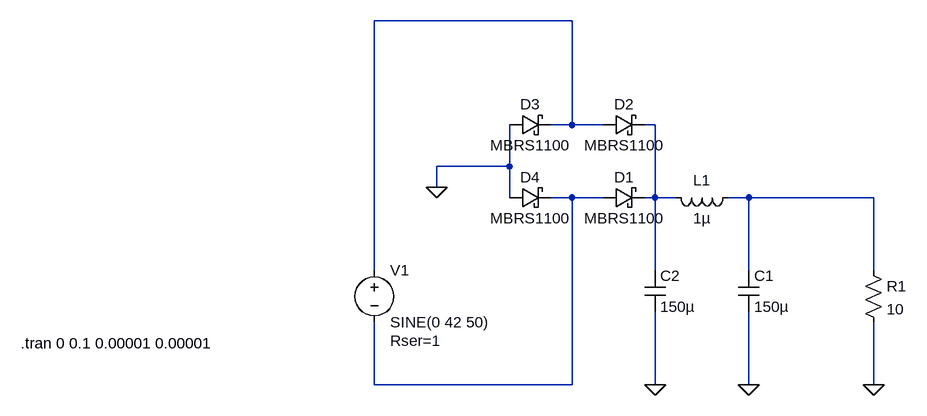
[diagram p0: schematic rectifier.asc]
rectifier.asc, the LTspice schematic file:
Version 4
SHEET 1 880 680
WIRE 160 -304 -144 -304
WIRE 160 -144 160 -304
WIRE 160 -144 128 -144
WIRE 208 -144 160 -144
WIRE 288 -144 272 -144
WIRE 64 -80 64 -144
WIRE 64 -80 -48 -80
WIRE -48 -48 -48 -80
WIRE 64 -32 64 -80
WIRE 160 -32 128 -32
WIRE 208 -32 160 -32
WIRE 288 -32 288 -144
WIRE 288 -32 272 -32
WIRE 320 -32 288 -32
WIRE 432 -32 400 -32
WIRE 624 -32 432 -32
WIRE -144 80 -144 -304
WIRE 288 80 288 -32
WIRE 432 80 432 -32
WIRE 624 80 624 -32
WIRE -144 256 -144 160
WIRE 160 256 160 -32
WIRE 160 256 -144 256
WIRE 288 256 288 144
WIRE 432 256 432 144
WIRE 624 256 624 160
FLAG 624 256 0
FLAG 432 256 0
FLAG 288 256 0
FLAG -48 -48 0
SYMBOL voltage -144 64 R0
WINDOW 123 0 0 Left 0
WINDOW 39 24 124 Left 2
SYMATTR SpiceLine Rser=1
SYMATTR InstName V1
SYMATTR Value SINE(0 42 50)
SYMBOL schottky 208 -16 R270
WINDOW 0 32 32 VTop 2
WINDOW 3 0 32 VBottom 2
SYMATTR InstName D1
SYMATTR Value MBRS1100
SYMATTR Description Diode
SYMATTR Type diode
SYMBOL res 608 64 R0
SYMATTR InstName R1
SYMATTR Value 10
SYMBOL cap 416 80 R0
SYMATTR InstName C1
SYMATTR Value 150µ
SYMATTR SpiceLine Rser=0.17
SYMBOL ind 416 -48 R90
WINDOW 0 5 56 VBottom 2
WINDOW 3 32 56 VTop 2
SYMATTR InstName L1
SYMATTR Value 1µ
SYMBOL cap 272 80 R0
SYMATTR InstName C2
SYMATTR Value 150µ
SYMATTR SpiceLine Rser=0.17
SYMBOL schottky 208 -128 R270
WINDOW 0 32 32 VTop 2
WINDOW 3 0 32 VBottom 2
SYMATTR InstName D2
SYMATTR Value MBRS1100
SYMATTR Description Diode
SYMATTR Type diode
SYMBOL schottky 64 -128 R270
WINDOW 0 32 32 VTop 2
WINDOW 3 0 32 VBottom 2
SYMATTR InstName D3
SYMATTR Value MBRS1100
SYMATTR Description Diode
SYMATTR Type diode
SYMBOL schottky 64 -16 R270
WINDOW 0 32 32 VTop 2
WINDOW 3 0 32 VBottom 2
SYMATTR InstName D4
SYMATTR Value MBRS1100
SYMATTR Description Diode
SYMATTR Type diode
TEXT -688 192 Left 2 !.tran 0 0.1 0.00001 0.00001

The netlist it stands for:
* rectifier.asc
V1 N001 N003 SINE(0 42 50) Rser=1
D1 N003 N002 MBRS1100
R1 N004 0 10
C1 N004 0 150µ Rser=0.17
L1 N004 N002 1µ
C2 N002 0 150µ Rser=0.17
D2 N001 N002 MBRS1100
D3 0 N001 MBRS1100
D4 0 N003 MBRS1100
.model D D
.lib standard.dio
.tran 0 0.1 0.00001 0.00001
.backanno
.end